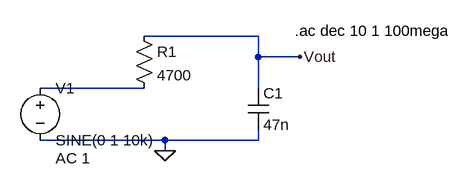
[diagram p0: schematic Draft1.asc]
Draft1.asc, the LTspice schematic file:
Version 4
SHEET 1 880 680
WIRE 320 64 144 64
WIRE 320 96 320 64
WIRE 384 96 320 96
WIRE 144 144 -16 144
WIRE 320 144 320 96
WIRE 176 224 -16 224
WIRE 320 224 320 208
WIRE 320 224 176 224
WIRE 176 240 176 224
FLAG 384 96 Vout
FLAG 176 240 0
SYMBOL res 128 48 R0
SYMATTR InstName R1
SYMATTR Value 4700
SYMBOL cap 304 144 R0
SYMATTR InstName C1
SYMATTR Value 47n
SYMBOL voltage -16 128 R0
WINDOW 123 24 124 Left 2
WINDOW 39 0 0 Left 0
SYMATTR InstName V1
SYMATTR Value SINE(0 1 10k)
SYMATTR Value2 AC 1
TEXT 376 56 Left 2 !.ac dec 10 1 100mega

The netlist it stands for:
* Draft1.asc
R1 Vout N001 4700
C1 Vout 0 47n
V1 N001 0 SINE(0 1 10k) AC 1
.ac dec 10 1 100mega
.backanno
.end